# EAGLE design sd_tos (EAGLE 6.2)
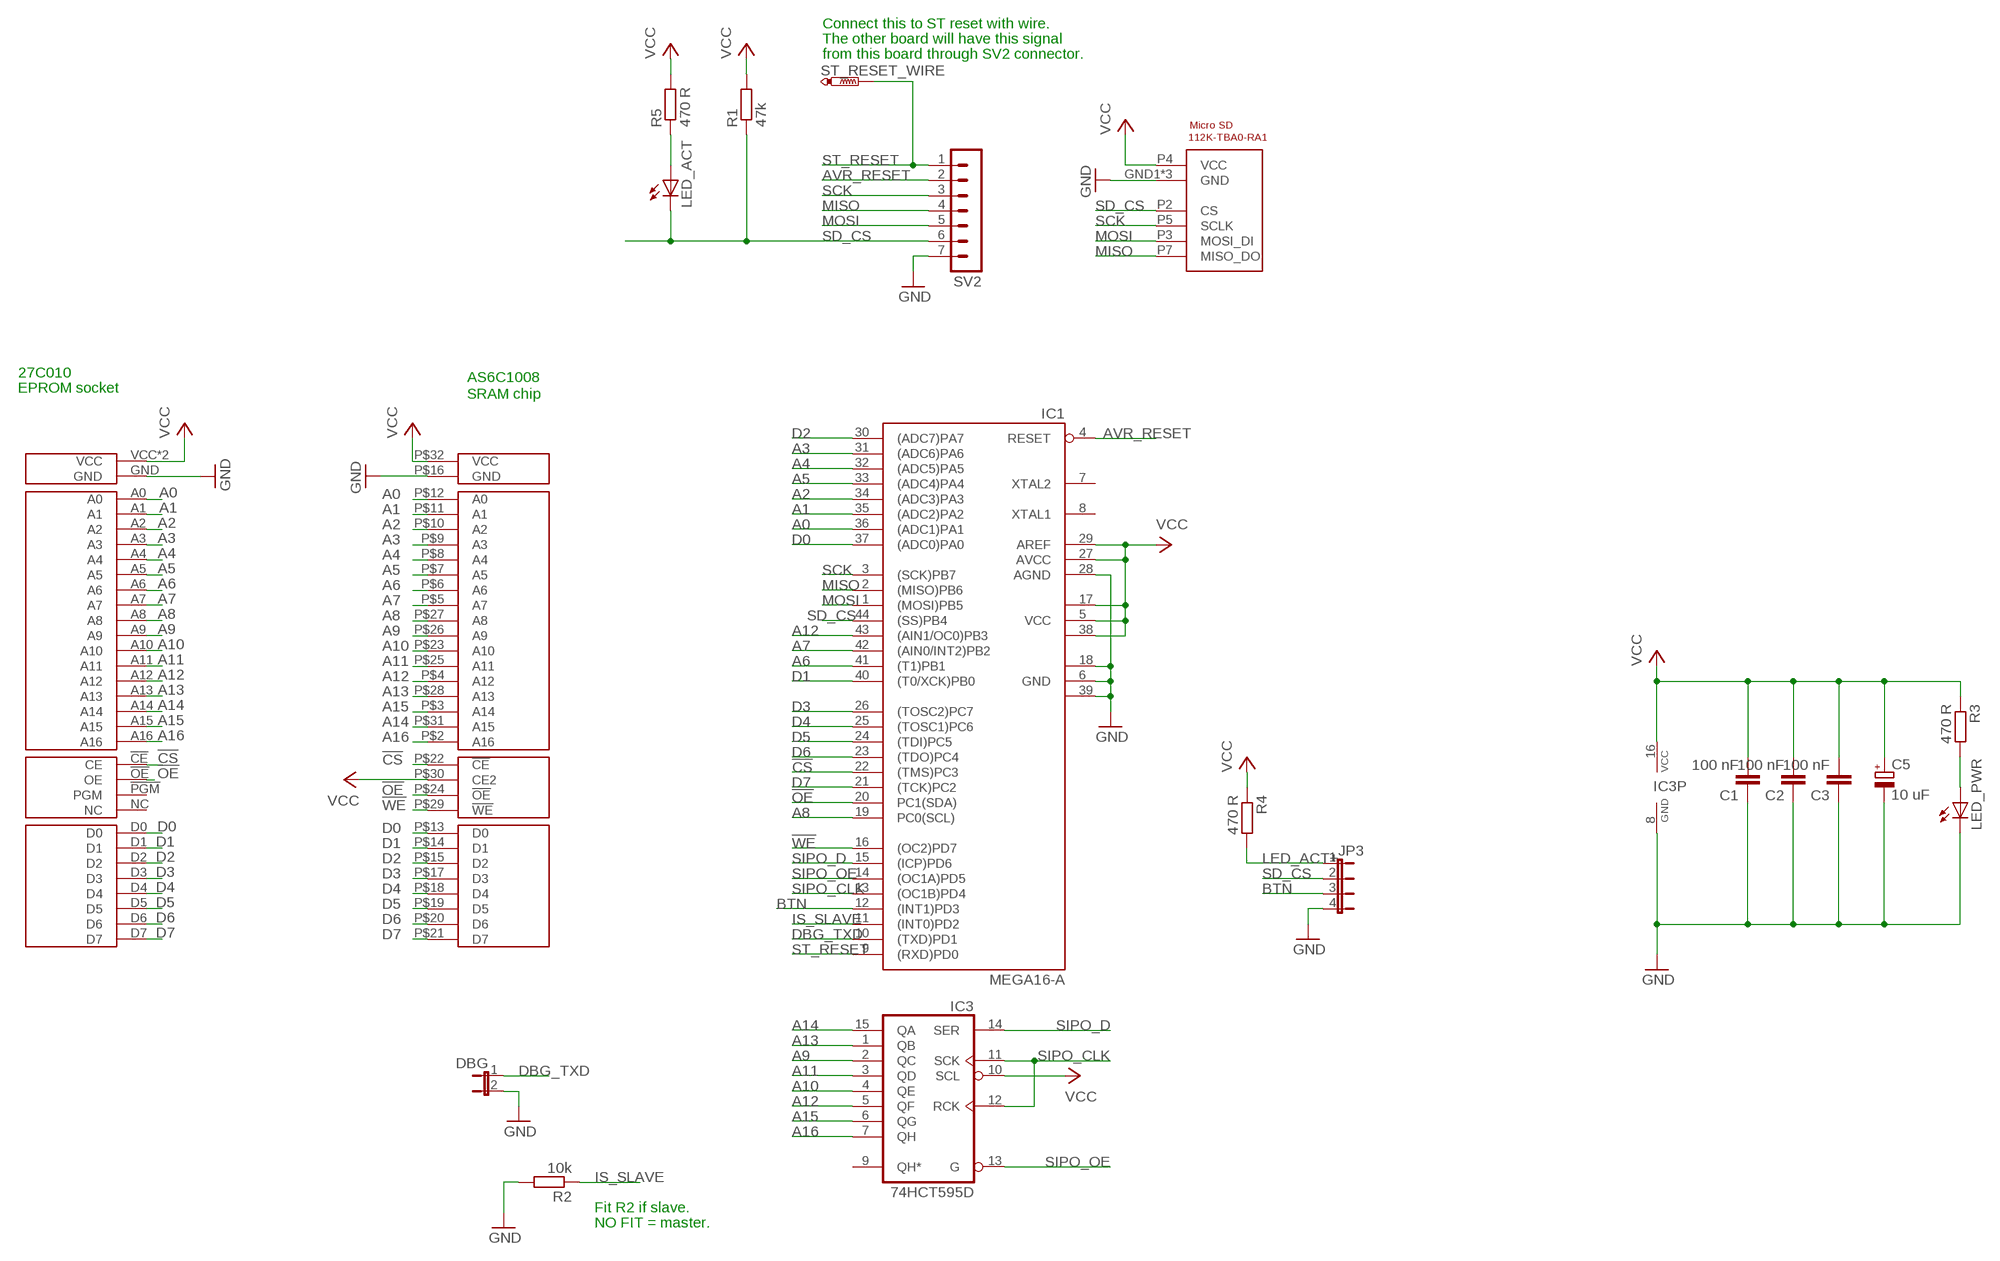
[diagram p0: schematic, sheet 1]

## Parts
C1  100 nF  C-EUC0603  [C0603]
C2  100 nF  C-EUC0603  [C0603]
C3  100 nF  C-EUC0603  [C0603]
C5  10 uF  CPOL-EUSANYO_SMD_B6  [SANYO-OSCON_SMD_B6]
DBG  JP1E  [JP1]
IC1  MEGA16-A  [TQFP44]
IC3  74HCT595D  [SO16]
JP3  JP4E  [JP4]
LED_ACT  LEDCHIP-LED0805  [CHIP-LED0805]
LED_PWR  LEDCHIP-LED0805  [CHIP-LED0805]
R1  47k  R-EU_R0603  [R0603]
R2  10k  R-EU_R0603  [R0603]
R3  470 R  R-EU_R0603  [R0603]
R4  470 R  R-EU_R0603  [R0603]
R5  470 R  R-EU_R0603  [R0603]
ST_RESET_WIRE  PTR1PAD1-13Y  [P1-13Y]
SV2  MA07-1  [MA07-1]
U$1  27C010_BOTTOM_ONLY  [DIP32_BOTTOM_ONLY]
U$2  AS6C1008  [SOP32L]
U$3  MICRO_SD  [MICRO_SD]

## Nets
!CS: IC1.22((TMS)PC3) U$1.!CE(CE) U$2.P$22(!CE)
!OE: IC1.20(PC1(SDA)) U$1.!OE(OE) U$2.P$24(!OE)
!WE: IC1.16((OC2)PD7) U$2.P$29(!WE)
A0: IC1.36((ADC1)PA1) U$1.A0 U$2.P$12(A0)
A1: IC1.35((ADC2)PA2) U$1.A1 U$2.P$11(A1)
A2: IC1.34((ADC3)PA3) U$1.A2 U$2.P$10(A2)
A3: IC1.31((ADC6)PA6) U$1.A3 U$2.P$9(A3)
A4: IC1.32((ADC5)PA5) U$1.A4 U$2.P$8(A4)
A5: IC1.33((ADC4)PA4) U$1.A5 U$2.P$7(A5)
A6: IC1.41((T1)PB1) U$1.A6 U$2.P$6(A6)
A7: IC1.42((AIN0/INT2)PB2) U$1.A7 U$2.P$5(A7)
A8: IC1.19(PC0(SCL)) U$1.A8 U$2.P$27(A8)
A9: IC3.2(QC) U$1.A9 U$2.P$26(A9)
A10: IC3.4(QE) U$1.A10 U$2.P$23(A10)
A11: IC3.3(QD) U$1.A11 U$2.P$25(A11)
A12: IC1.43((AIN1/OC0)PB3) IC3.5(QF) U$1.A12 U$2.P$4(A12)
A13: IC3.1(QB) U$1.A13 U$2.P$28(A13)
A14: IC3.15(QA) U$1.A14 U$2.P$31(A15)
A15: IC3.6(QG) U$1.A15 U$2.P$3(A14)
A16: IC3.7(QH) U$1.A16 U$2.P$2(A16)
AVR_RESET: IC1.4(RESET) SV2.2
BTN: IC1.12((INT1)PD3) JP3.3
D0: IC1.37((ADC0)PA0) U$1.D0 U$2.P$13(D0)
D1: IC1.40((T0/XCK)PB0) U$1.D1 U$2.P$14(D1)
D2: IC1.30((ADC7)PA7) U$1.D2 U$2.P$15(D2)
D3: IC1.26((TOSC2)PC7) U$1.D3 U$2.P$17(D3)
D4: IC1.25((TOSC1)PC6) U$1.D4 U$2.P$18(D4)
D5: IC1.24((TDI)PC5) U$1.D5 U$2.P$19(D5)
D6: IC1.23((TDO)PC4) U$1.D6 U$2.P$20(D6)
D7: IC1.21((TCK)PC2) U$1.D7 U$2.P$21(D7)
DBG_TXD: DBG.1 IC1.10((TXD)PD1)
GND: C1.1 C2.1 C3.1 C5.- DBG.2 IC1.6(GND) IC1.18(GND1) IC1.28(AGND) IC1.39(GND2) IC3.8(GND) JP3.4 LED_PWR.C R2.2 SV2.7 U$1.GND U$2.P$16(GND) U$3.GND1(GND) U$3.GND2(GND) U$3.P6(GND)
IS_SLAVE: IC1.11((INT0)PD2) R2.1
LED_ACT+: JP3.1 R4.2
MISO: IC1.2((MISO)PB6) SV2.4 U$3.P7(MISO_DO)
MOSI: IC1.1((MOSI)PB5) SV2.5 U$3.P3(MOSI_DI)
N$1: LED_PWR.A R3.2
N$2: LED_ACT.A R5.1
SCK: IC1.3((SCK)PB7) SV2.3 U$3.P5(SCLK)
SD_CS: IC1.44((SS)PB4) JP3.2 LED_ACT.C R1.1 SV2.6 U$3.P2(CS)
SIPO_CLK: IC1.13((OC1B)PD4) IC3.11(SCK) IC3.12(RCK)
SIPO_D: IC1.15((ICP)PD6) IC3.14(SER)
SIPO_OE: IC1.14((OC1A)PD5) IC3.13(G)
ST_RESET: IC1.9((RXD)PD0) ST_RESET_WIRE.TP SV2.1
VCC: C1.2 C2.2 C3.2 C5.+ IC1.5(VCC) IC1.17(VCC1) IC1.27(AVCC) IC1.29(AREF) IC1.38(VCC2) IC3.10(SCL) IC3.16(VCC) R1.2 R3.1 R4.1 R5.2 U$1.VCC U$1.VPP(VCC) U$2.P$30(CE2) U$2.P$32(VCC) U$3.P4(VCC)
Unconnected: IC1.7(XTAL2) IC1.8(XTAL1) IC3.9(QH*) U$1.!PGM(PGM) U$1.NC

## Notes on the sheet
- Connect this to ST reset with wire.
- The other board will have this signal
- from this board through SV2 connector.
- 27C010
- AS6C1008
- EPROM socket
- SRAM chip
- Fit R2 if slave.
- NO FIT = master.

## Library data of the parts
C1-C3 = rcl:C-EU: CAPACITOR, European symbol
C5 = rcl:CPOL-EU: POLARIZED CAPACITOR, European symbol
DBG = jumper:JP1E: JUMPER
IC1 = avr-6:MEGA16: MICROCONTROLLER 16 Kbytes FLASH 1 kbytes SRAM 512 bytes EEPROM USART 8-channel 10 bit ADC
IC3 = 74xx-eu:74*595: 8-bit SHIFT REGISTER, output latch
JP3 = jumper:JP4E: JUMPER
LED_ACT LED_PWR = led:LED: LED OSRAM: - CHIPLED LG R971, LG N971, LY N971, LG Q971, LY Q971, LO R971, LY R971 LH N974, LH R974 LS Q976, LO Q976, LY Q976 LO Q996 - Hyper CHIPLED LW Q18S LB Q993, LB Q99A, LB R99A - SideLED LS A670, LO A670, LY A670, LG A670, LP A670 LB A673, LV A673, LT A673, LW A673 LH A674 LY A675 LS A676, LA A676, LO A676, LY A676, LW A676 LS A679, LY A679, LG A679 - Hyper Micro SIDELED® LS Y876, LA Y876, LO Y876, LY Y876 LT Y87S - SmartLED LW L88C, LW L88S LB L89C, LB L89S, LG L890 LS L89K, LO L89K, LY L89K LS L896, LA L896, LO L896, LY L896 - TOPLED LS T670, LO T670, LY T670, LG T670, LP T670 LSG T670, LSP T670, LSY T670, LOP T670, LYG T670 LG T671, LOG T671, LSG T671 LB T673, LV T673, LT T673, LW T673 LH T674 LS T676, LA T676, LO T676, LY T676, LB T676, LH T676, LSB T676, LW T676 LB T67C, LV T67C, LT T67C, LS T67K, LO T67K, LY T67K, LW E67C LS E67B, LA E67B, LO E67B, LY E67B, LB E67C, LV E67C, LT E67C LW T67C LS T679, LY T679, LG T679 LS T770, LO T770, LY T770, LG T770, LP T770 LB T773, LV T773, LT T773, LW T773 LH T774 LS E675, LA E675, LY E675, LS T675 LS T776, LA T776, LO T776, LY T776, LB T776 LHGB T686 LT T68C, LB T68C - Hyper Mini TOPLED® LB M676 - Mini TOPLED Santana® LG M470 LS M47K, LO M47K, LY M47K Source: http://www.osram.convergy.de LUXEON: - LUMILED® LXK2-PW12-R00, LXK2-PW12-S00, LXK2-PW14-U00, LXK2-PW14-V00 LXK2-PM12-R00, LXK2-PM12-S00, LXK2-PM14-U00 LXK2-PE12-Q00, LXK2-PE12-R00, LXK2-PE12-S00, LXK2-PE14-T00, LXK2-PE14-U00 LXK2-PB12-K00, LXK2-PB12-L00, LXK2-PB12-M00, LXK2-PB14-N00, LXK2-PB14-P00, LXK2-PB14-Q00 LXK2-PR12-L00, LXK2-PR12-M00, LXK2-PR14-Q00, LXK2-PR14-R00 LXK2-PD12-Q00, LXK2-PD12-R00, LXK2-PD12-S00 LXK2-PH12-R00, LXK2-PH12-S00 LXK2-PL12-P00, LXK2-PL12-Q00, LXK2-PL12-R00 Source: www.luxeon.com KINGBRIGHT: KA-3528ASYC Source: www.kingbright.com
R1-R5 = rcl:R-EU_: RESISTOR, European symbol
ST_RESET_WIRE = testpad:PTR1: TEST PIN
SV2 = con-lstb:MA07-1: PIN HEADER; OC_FARNELL: unknown; OC_NEWARK: unknown
U$1 = sd_tos:27C010_BOTTOM_ONLY
U$2 = sd_tos:AS6C1008
U$3 = sd_tos:MICRO_SD

## Board
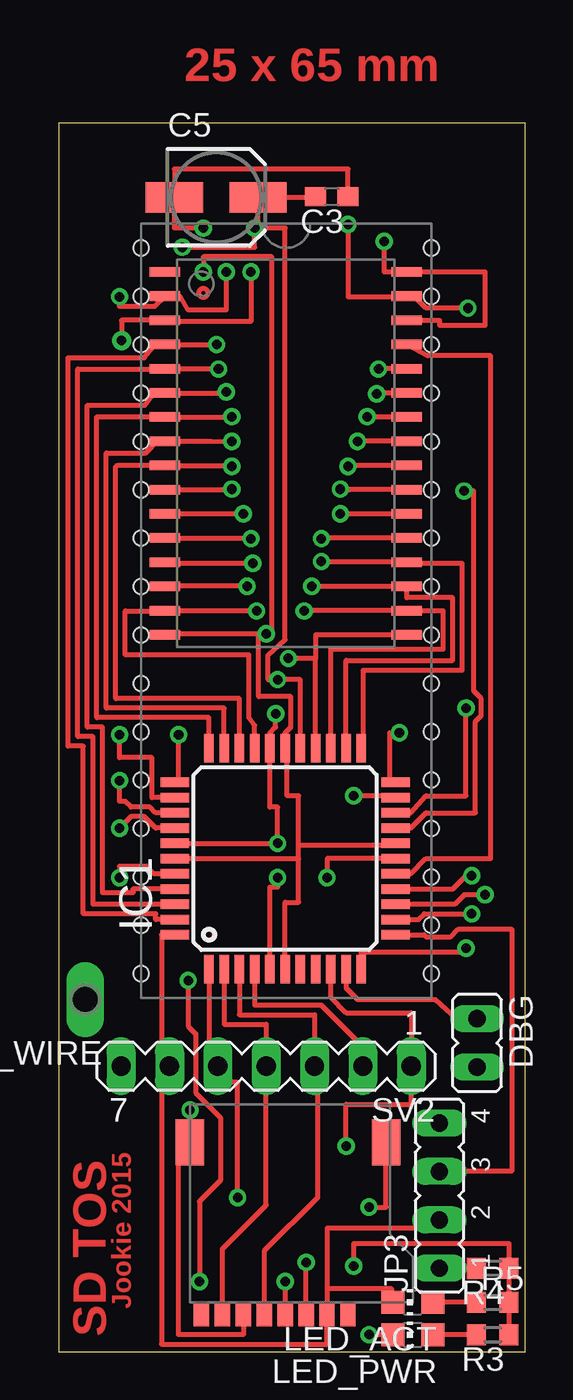
[diagram p1: board, top side]
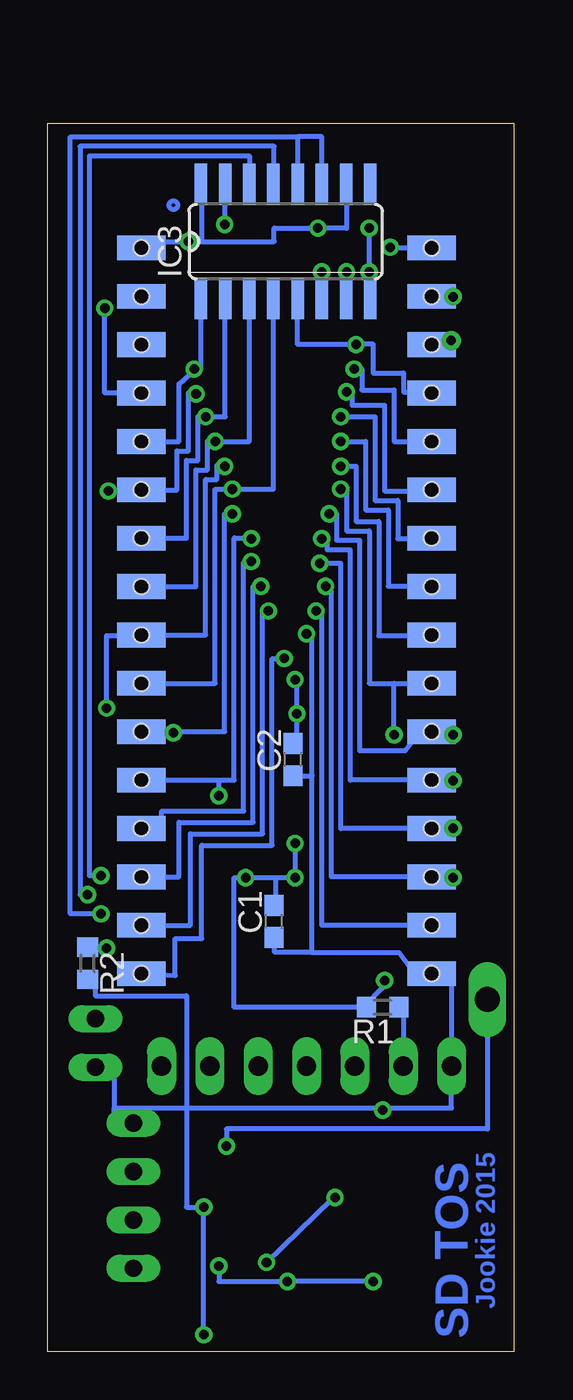
[diagram p2: board, bottom side, seen from below]

Size 24.5 x 64.5 mm. Coordinates in mm from the lower left corner, seen from the top.
Outline: 0,0 24.5,0 24.5,64.5 0,64.5 0,0
Copper layers (1*16): Top 0.035mm / dielectric 1.5mm / Bottom 0.035mm
Design rules: minimum track width 0.2mm, minimum drill 0.5mil, track to track 0.2mm, track to pad 0.2mm, pad to pad 0.2mm, via to via 0.2mm, smd to smd 0mil, copper to edge 0.1mm, drill to drill 0.1mm, minimum pad ring 10mil, minimum via ring 8mil, stop-mask expansion 4mil, vias tented up to drill 0mil, thermal gap 10mil

### Footprints (pad centres in the part's own frame; a part is rotated, then mirrored left to right if it is on the bottom)
C0603 = smd 1.1 x 1: 1 -0.85,0; 2 0.85,0
SANYO-OSCON_SMD_B6 = smd 3 x 1.6: + 2.2,0; - -2.2,0
JP1 = drill 0.914 long: 1 0,-1.27; 2 0,1.27
TQFP44 = smd 1.5 x 0.5: 1 -5.8,4; 2 -5.8,3.2; 3 -5.8,2.4; 4 -5.8,1.6; 5 -5.8,0.8; 6 -5.8,0; 7 -5.8,-0.8; 8 -5.8,-1.6; 9 -5.8,-2.4; 10 -5.8,-3.2; 11 -5.8,-4; 23 5.8,-4; 24 5.8,-3.2; 25 5.8,-2.4; 26 5.8,-1.6; 27 5.8,-0.8; 28 5.8,0; 29 5.8,0.8; 30 5.8,1.6; 31 5.8,2.4; 32 5.8,3.2; 33 5.8,4 | smd 0.5 x 1.5: 12 -4,-5.8; 13 -3.2,-5.8; 14 -2.4,-5.8; 15 -1.6,-5.8; 16 -0.8,-5.8; 17 0,-5.8; 18 0.8,-5.8; 19 1.6,-5.8; 20 2.4,-5.8; 21 3.2,-5.8; 22 4,-5.8; 34 4,5.8; 35 3.2,5.8; 36 2.4,5.8; 37 1.6,5.8; 38 0.8,5.8; 39 0,5.8; 40 -0.8,5.8; 41 -1.6,5.8; 42 -2.4,5.8; 43 -3.2,5.8; 44 -4,5.8
SO16 = smd 0.66 x 2.032: 1 -4.445,-3.073; 2 -3.175,-3.073; 3 -1.905,-3.073; 4 -0.635,-3.073; 5 0.635,-3.073; 6 1.905,-3.073; 7 3.175,-3.073; 8 4.445,-3.073; 9 4.445,3.073; 10 3.175,3.073; 11 1.905,3.073; 12 0.635,3.073; 13 -0.635,3.073; 14 -1.905,3.073; 15 -3.175,3.073; 16 -4.445,3.073
JP4 = drill 0.914 long: 1 -3.81,0; 2 -1.27,0; 3 1.27,0; 4 3.81,0
CHIP-LED0805 = smd 1.2 x 1.2: A 0,-1.05; C 0,1.05
R0603 = smd 1 x 1.1: 1 -0.85,0; 2 0.85,0
P1-13Y = drill 1.321 pad 1.905 long: TP 0,0
MA07-1 = drill 1.016 long: 1 -7.62,0; 2 -5.08,0; 3 -2.54,0; 4 0,0; 5 2.54,0; 6 5.08,0; 7 7.62,0
DIP32_BOTTOM_ONLY = smd 2.54 x 1.3 bottom: !CE 7.62,-5.08; !OE 7.62,0; !PGM 7.62,17.78; A0 -7.62,-7.62; A1 -7.62,-5.08; A2 -7.62,-2.54; A3 -7.62,0; A4 -7.62,2.54; A5 -7.62,5.08; A6 -7.62,7.62; A7 -7.62,10.16; A8 7.62,7.62; A9 7.62,5.08; A10 7.62,-2.54; A11 7.62,2.54; A12 -7.62,12.7; A13 7.62,10.16; A14 7.62,12.7; A15 -7.62,15.24; A16 -7.62,17.78; D0 -7.62,-10.16; D1 -7.62,-12.7; D2 -7.62,-15.24; D3 7.62,-17.78; D4 7.62,-15.24; D5 7.62,-12.7; D6 7.62,-10.16; D7 7.62,-7.62; GND -7.62,-17.78; NC 7.62,15.24; VCC 7.62,20.32; VPP -7.62,20.32 | hole 0.8: -7.62,20.32; -7.62,17.78; -7.62,15.24; -7.62,12.7; -7.62,10.16; -7.62,7.62; -7.62,5.08; -7.62,2.54; -7.62,0; -7.62,-2.54; -7.62,-5.08; -7.62,-7.62; -7.62,-10.16; -7.62,-12.7; -7.62,-15.24; -7.62,-17.78; 7.62,-17.78; 7.62,-15.24; 7.62,-12.7; 7.62,-10.16; 7.62,-7.62; 7.62,-5.08; 7.62,-2.54; 7.62,0; 7.62,2.54; 7.62,5.08; 7.62,7.62; 7.62,10.16; 7.62,12.7; 7.62,15.24; 7.62,17.78; 7.62,20.32
SOP32L = smd 1.6 x 0.5: P$1 -7.62,12.7; P$2 -7.62,11.43; P$3 -7.62,10.16; P$4 -7.62,8.89; P$5 -7.62,7.62; P$6 -7.62,6.35; P$7 -7.62,5.08; P$8 -7.62,3.81; P$9 -7.62,2.54; P$10 -7.62,1.27; P$11 -7.62,0; P$12 -7.62,-1.27; P$13 -7.62,-2.54; P$14 -7.62,-3.81; P$15 -7.62,-5.08; P$16 -7.62,-6.35; P$17 5.08,-6.35; P$18 5.08,-5.08; P$19 5.08,-3.81; P$20 5.08,-2.54; P$21 5.08,-1.27; P$22 5.08,0; P$23 5.08,1.27; P$24 5.08,2.54; P$25 5.08,3.81; P$26 5.08,5.08; P$27 5.08,6.35; P$28 5.08,7.62; P$29 5.08,8.89; P$30 5.08,10.16; P$31 5.08,11.43; P$32 5.08,12.7
MICRO_SD = smd 1.5 x 2.4: GND1 -5,9; GND2 5.3,9 | smd 0.8 x 1.3: P1 3.3,0; P2 2.2,0; P3 1.1,0; P4 0,0; P5 -1.1,0; P6 -2.2,0; P7 -3.3,0; P8 -4.4,0

### Placement (x,y rotation side)
C1  12.6,22.6 90 bottom
C2  11.6,31.1 90 bottom
C3  14.35,60.64 180 top
C5  8.28,60.62 0 top
DBG  21.99,16.22 180 top
IC1  11.9,25.9 90 top
IC3  12,58.3 0 bottom
JP3  20,8.2 90 top
LED_ACT  18.6,2.6 90 top
LED_PWR  18.6,0.9 90 top
R1  6.9,18.1 180 bottom
R2  22.4,20.4 270 bottom
R3  22.8,0.9 180 top
R4  22.8,4.4 180 top
R5  22.8,2.6 0 top
ST_RESET_WIRE  1.4,18.5 180 top
SV2  10.9,15 180 top
U$1  11.95,37.64 0 top
U$2  13.2,44 0 top
U$3  11.9,2 0 top

### Tracks (layer width: path | path; a pad name or v marks a point on that pad's centre or on a via)
!CS  (via drill 0.5 pad 0.8)
  Top 0.25: U$2.P$22 v14.8,44 | 17.8,29.9 IC1.22 17.4,29.9 17.4,32.5 v17.9,32.5
  Bottom 0.25: U$1.!CE 18.9,32.56 | 18.9,32.56 15.2,32.56 15.2,44 v14.8,44 | v17.9,32.5 18.9,32.56
!OE  (via drill 0.5 pad 0.8)
  Top 0.25: U$2.P$24 15.3,46.54 v15.2,46.5 | IC1.20 18.5,28.3 19.3,29.2 21.4,29.2 v21.4,33.8
  Bottom 0.25: v15.2,46.5 15.3,46.54 15.6,46.54 15.6,45.8 16.2,45.8 16.2,37.64 U$1.!OE 19.57,37.6 21.4,37.6 v21.4,33.8
!WE
  Top 0.25: IC1.16 18.5,25.1 19.3,25.9 22.7,25.9 22.7,52.3 19.37,52.3 U$2.P$29
A0  (via drill 0.5 pad 0.8)
  Top 0.25: v10.1,42.7 5.58,42.7 U$2.P$12 | IC1.36 5.1,28.3 4.8,28.6 3.8,28.6 3.5,28.9 3.2,28.9 v3.2,30
  Bottom 0.25: v10.1,42.7 9.8,42.7 9.8,42.1 8.6,42.1 8.6,30.02 U$1.A0 4.31,30 v3.2,30
A1  (via drill 0.5 pad 0.8)
  Top 0.25: v9.7,44 U$2.P$11 | IC1.35 4.9,29.1 4.9,31.2 3.2,31.2 v3.2,32.4
  Bottom 0.25: v9.7,44 9.3,44 9.3,42.6 8.1,42.6 8.1,31.56 5.72,31.55 4.92,32.57 U$1.A1 4.33,32.5 v3.2,32.4
A2  (via drill 0.5 pad 0.8)
  Top 0.25: U$2.P$10 8.9,45.27 v9.1,45.3 | IC1.34 6.3,29.9 v6.3,32.4
  Bottom 0.25: v9.1,45.3 8.8,45.3 8.8,43.1 7.6,43.1 7.6,35.1 6.3,35.1 | 6.3,35.1 U$1.A2 | v6.3,32.4 6.3,35.1
A3  (via drill 0.5 pad 0.8)
  Top 0.25: v9.1,46.5 9.1,46.54 U$2.P$9 3.1,46.54 3,46.5 3,34.3 9.5,34.3 IC1.31
  Bottom 0.25: v9.1,46.5 8.3,46.5 8.3,43.6 7.1,43.6 7.1,37.6 4.33,37.6 U$1.A3
A4  (via drill 0.5 pad 0.8)
  Top 0.25: U$2.P$8 8,47.81 v9.1,47.8 | 5.17,47.8 5.2,47.8 U$2.P$8 | IC1.32 8.7,33.8 2.5,33.8 2.5,47.2 4.57,47.2 4.9,47.53 5.1,47.8 U$2.P$8
  Bottom 0.25: v9.1,47.8 7.8,47.8 7.8,44.2 6.6,44.2 6.6,40.2 4.33,40.2 U$1.A4
A5  (via drill 0.5 pad 0.8)
  Top 0.25: v9.1,49.1 9.1,49.08 U$2.P$7 5.58,49.1 2,49.1 2,33.3 7.9,33.3 IC1.33
  Bottom 0.25: v9.1,49.1 7.3,49.1 7.3,44.7 6.1,44.7 6.1,42.7 4.33,42.7 U$1.A5
A6  (via drill 0.5 pad 0.8)
  Top 0.25: v8.8,50.4 8.5,50.35 U$2.P$6 5.53,50.3 5,50.3 4.53,49.7 1.5,49.7 1.5,32.8 2.3,32.8 2.3,24.1 3.9,24.1 3.9,24.3 IC1.41
  Bottom 0.25: v8.8,50.4 8.5,50.4 8.5,49.7 6.8,49.7 6.8,45.2 4.33,45.2 U$1.A6
A7  (via drill 0.5 pad 0.8)
  Top 0.25: v8.4,51.6 8.4,51.62 U$2.P$5 5.58,51.6 1,51.6 1,32.3 1.8,32.3 1.8,23.5 IC1.42
  Bottom 0.25: v8.4,51.6 8,51.6 8,50.5 6.3,50.5 6.3,47.8 U$1.A7
A8  (via drill 0.5 pad 0.8)
  Top 0.25: U$2.P$27 17,50.35 v16.7,50.3 | IC1.19 18.5,27.5 19.3,28.3 21.9,28.3 21.9,33.1 22.2,33.4 22.2,34.3 21.8,34.7 21.8,45.2 v21.3,45.2
  Bottom 0.25: v16.7,50.3 16.9,50.35 17.1,50.35 17.1,47.3 17.7,47.3 17.7,45.26 U$1.A8 19.57,45.2 v21.3,45.2
A9  (via drill 0.5 pad 0.8)
  Top 0.25: U$2.P$26 16.3,49.08 v16.2,49.1
  Bottom 0.25: U$1.A9 17.2,42.72 17.2,46.8 16.6,46.8 16.6,49.08 16.4,49.08 v16.2,49.1 15.17,49.1 IC3.2
A10  (via drill 0.5 pad 0.8)
  Top 0.25: U$2.P$23 15.3,45.27 v14.8,45.3
  Bottom 0.25: U$1.A10 15.7,35.1 15.7,45.3 15.1,45.3 15.1,45.27 15,45.27 v14.8,45.3 12.63,45.3 IC3.4
A11  (via drill 0.5 pad 0.8)
  Top 0.25: U$2.P$25 15.8,47.81 v15.7,47.8
  Bottom 0.25: U$1.A11 16.7,40.18 16.7,46.3 16.1,46.3 16.1,47.81 v15.7,47.8 13.91,47.8 IC3.3
A12  (via drill 0.5 pad 0.8)
  Top 0.25: v8.3,52.89 U$2.P$4 5.1,52.9 4.49,52.2 0.5,52.2 0.5,31.8 1.3,31.8 1.3,23 5.1,23 5.1,22.7 IC1.43
  Bottom 0.25: U$1.A12 4.33,50.4 5.8,50.4 5.8,51.4 7.4,51.4 7.4,52.9 v8.3,52.9 v8.3,52.89 11.37,52.89 IC3.5
A13  (via drill 0.5 pad 0.8)
  Top 0.25: U$2.P$28 16.8,51.62 v16.8,51.6
  Bottom 0.25: U$1.A13 17.6,47.8 17.6,50.82 16.7,51.62 v16.8,51.6 16.8,51.62 16.45,51.62 IC3.1
A14  (via drill 0.5 pad 0.8)
  Top 0.25: v21.5,54.8 19.3,54.8 18.8,55.3 18.41,55.3 U$2.P$31 18.28,55.4 15.2,55.4 v15.2,59.2
  Bottom 0.25: U$1.A14 21.5,50.34 v21.5,54.8 | IC3.15 15.2,61.37 v15.2,59.2
A15  (via drill 0.5 pad 0.8, 0.5 pad 1)
  Top 0.25: v3.3,53.1 3.3,54.16 U$2.P$3 5.58,54.1 10.1,54.1 v10.1,56.7
  Bottom 0.25: v3.3,53.1 4.33,52.9 U$1.A15 | IC3.6 v10.1,56.7
A16  (via drill 0.5 pad 0.8)
  Top 0.25: v3.2,55.4 3.2,54.9 5.05,54.9 U$2.P$2 5.58,55.4 6.4,55.4 6.8,54.7 8.8,54.7 v8.8,56.7
  Bottom 0.25: U$1.A16 3.22,55.42 v3.2,55.4 | IC3.7 8.8,55.23 v8.8,56.7
AVR_RESET
  Top 0.2: SV2.2 15.8,15 15.8,16.2
  Top 0.25: IC1.4 10.3,18.2 13.8,18.2 15.8,16.2
BTN
  Top 0.25: IC1.12 19.2,21.9 19.3,21.8 20.6,21.8 21,22.2 23.8,22.2 23.8,9.48 JP3.3
D0  (via drill 0.5 pad 0.8)
  Top 0.25: v10.2,41.4 5.58,41.4 U$2.P$13 | IC1.37 5.1,27.5 4.5,28.1 3.8,28.1 v3.2,27.5
  Bottom 0.25: v10.2,41.4 9.1,41.4 9.1,27.48 U$1.D0 4.31,27.5 v3.2,27.5
D1  (via drill 0.5 pad 0.8)
  Top 0.25: v9.9,40.2 U$2.P$14 | IC1.40 5,25.1 4.6,25.5 3.2,25.5 v3.2,24.9
  Bottom 0.25: v9.9,40.2 9.6,40.2 9.6,24.94 U$1.D1 4.19,24.8 3.2,24.8 v3.2,24.9
D2  (via drill 0.5 pad 0.8)
  Top 0.25: v10.4,38.9 5.58,38.9 | IC1.30 10.3,32.9 10,33.3 10,36.6 3.5,36.6 3.5,38.9 5.58,38.9 | 5.58,38.9 U$2.P$15
  Bottom 0.25: U$1.D2 10.1,22.4 10.1,38.9 v10.4,38.9
D3  (via drill 0.5 pad 0.8)
  Top 0.25: U$2.P$17 13.5,37.65 13.5,36.4 | IC1.26 13.5,36.4 | 13.5,36.4 v12.07,36.41
  Bottom 0.25: U$1.D3 17.8,19.76 17.8,21.7 16.4,21.7 16.4,26.6 12.7,26.6 12.7,36.4 v12.07,36.41
D4  (via drill 0.5 pad 0.8)
  Top 0.25: v12.9,38.9 12.9,38.92 U$2.P$18 18.28,38.9 20.2,38.9 20.2,36.9 14.3,36.9 IC1.25
  Bottom 0.25: U$1.D4 17,22.4 17,27.2 13.2,27.2 13.2,38.9 v12.9,38.9
D5  (via drill 0.5 pad 0.8)
  Top 0.25: v13.3,40.2 v13.3,40.19 U$2.P$19 18.28,39.6 20.7,39.6 20.7,36.3 15.1,36.3 IC1.24
  Bottom 0.25: U$1.D5 17.6,24.94 17.6,27.8 13.7,27.8 13.7,40.19 13.2,40.19 v13.3,40.2
D6  (via drill 0.5 pad 0.8)
  Top 0.25: v13.8,41.5 13.9,41.46 U$2.P$20 18.28,41.4 21.2,41.4 21.2,35.8 16,35.8 16,31.7 IC1.23
  Bottom 0.25: U$1.D6 18.5,27.48 18.5,28.4 14.2,28.4 14.2,41.46 13.9,41.46 v13.8,41.5
D7  (via drill 0.5 pad 0.8)
  Top 0.25: U$2.P$21 13.7,42.73 v13.8,42.7 | IC1.21 17.7,29.2 v15.5,29.2
  Bottom 0.25: U$1.D7 15.5,30.02 | 15.5,30.02 14.7,30.02 14.7,42.73 13.9,42.73 v13.8,42.7 | v15.5,29.2 15.5,30.02
DBG_TXD
  Top 0.25: IC1.10 15.1,19.1 15.7,18.5 19.8,18.5 20.9,17.5 22.1,17.5 DBG.1
GND  (via drill 0.5 pad 0.8)
  Top 0.25: 10.5,37.7 v10.9,37.7 11.2,37.7 11.2,57.5 7.6,57.5 v7.6,56.7 | 10.5,37.7 5.58,37.7 U$2.P$16 | v7.6,59 6.08,59 C5.- 6.08,62.1 15.2,62.1 C3.1 | 10.5,37.7 10.5,34.4 12.2,34.4 12.2,32.8 11.9,32.5 IC1.28 12,31.7 12,29.2 12.6,29.2 12.6,26.6 | IC1.39 12.6,25.9 | 12.6,25.9 12.6,26.6 | IC1.18 17.7,26.6 12.6,26.6 | IC1.6 11.9,23.6 12.6,23.6 12.6,25.9 | U$3.P6 9.7,0.9 6.3,0.9 6.3,11.1 6.9,11.1 U$3.GND1 v6.9,12.7 | v16.3,7.6 17.2,7.6 U$3.GND2 | LED_PWR.C v16.3,0.9
  Bottom 0.25: 10.6,21 10.6,30.25 | 10.6,30.25 10.6,37.7 v10.9,37.7 | IC3.8 7.6,55.23 v7.6,56.7 v7.6,59 | C2.1 10.6,30.25 | C1.1 12.6,21 10.6,21 | 10.6,21 10.6,20.96 6.02,20.96 5.2,19.85 U$1.GND 3.28,19.86 SV2.7 3.28,12.8 6.8,12.8 | DBG.2 21,14.93 21,12.8 | 21,12.8 17.2,12.8 | 17.2,12.8 6.8,12.8 | R2.2 22,19.55 22,18.7 17.2,18.7 17.2,12.8 | v6.9,12.7 6.8,12.8 | v16.3,0.9 v16.3,7.6 17.2,7.6 17.2,12.8 | JP3.4 21,12.01 21,12.8
IS_SLAVE  (via drill 0.5 pad 0.8)
  Top 0.25: IC1.11 15.9,21 21.2,21 v21.4,21.2
  Bottom 0.25: v21.4,21.2 22.4,21.2 R2.1
LED_ACT+
  Top 0.25: JP3.1 R4.2
MISO
  Top 0.25: IC1.2 8.7,17.2 10.9,17.2 SV2.4 10.9,7.7 8.6,5.4 U$3.P7
MOSI  (via drill 0.5 pad 0.8)
  Top 0.25: IC1.1 7.9,16.2 8.36,16.2 | U$3.P3 v13,4.7 | v9.4,8.1 9.4,14.15 8.36,14.15 SV2.5 8.36,16.2 | 8.53,16.2 8.36,16.2
  Bottom 0.25: v13,4.7 9.6,8 v9.4,8.1
N$1
  Top 0.25: R3.2 LED_PWR.A
N$2
  Top 0.25: R5.1 LED_ACT.A
SCK
  Top 0.25: IC1.3 9.5,17.7 13.44,17.7 SV2.3 13.44,15.3 13.6,15.3 13.6,8.1 10.8,5.3 U$3.P5
SD_CS
  Top 0.25: IC1.44 5.4,21.9 5.4,15 | 5.4,15 5.4,0.4 14.1,0.4 U$3.P2 14.1,3.3 | 14.1,3.3 14.1,6.5 19,6.5 19,6.93 JP3.2 | SV2.6 5.4,15 | LED_ACT.C 17.5,2.4 17.5,3.3 14.1,3.3
  Bottom 0.25: R1.1 5.82,18.1 SV2.6
SIPO_CLK  (via drill 0.5 pad 0.8)
  Top 0.25: IC1.13 18.9,22.7 19.2,23 v21.7,23
  Bottom 0.25: IC3.11 10.1,63.8 11.37,63.8 | 11.37,63.8 IC3.12 | v21.7,23 23.3,23 23.3,63.8 11.37,63.8
SIPO_D  (via drill 0.5 pad 0.8)
  Top 0.25: IC1.15 20.7,24.3 21.4,25 v21.7,25
  Bottom 0.25: v21.7,25 22.3,25 22.3,62.8 13.91,62.8 IC3.14
SIPO_OE  (via drill 0.5 pad 0.8)
  Top 0.25: v22.4,24 21.3,24 20.8,23.5 IC1.14
  Bottom 0.25: IC3.13 12.6,61.37 12.6,63.3 22.8,63.3 22.8,24 v22.4,24
ST_RESET  (via drill 0.5 pad 0.8)
  Top 0.25: IC1.9 14.3,18.6 15.1,17.8 18.52,17.8 SV2.1 18.52,13 15.1,13 v15.1,10.8
  Bottom 0.25: ST_RESET_WIRE.TP 1.4,11.7 15.1,11.7 v15.1,10.8
VCC  (via drill 0.5 pad 0.8)
  Top 0.25: 18.28,54.2 U$2.P$30 20,54.16 20,53.9 22.4,53.9 22.4,56.7 U$2.P$32 17.1,56.7 v17.1,58.3 | C3.2 13.5,60.62 C5.+ 10.48,59 v10.3,59 | IC1.27 12.7,35.3 v11.5,35.3 11,35.3 11,36.6 11.9,37.4 11.9,59 v10.3,59 | IC1.38 v11.5,26.7 11.5,28.6 11.1,28.6 IC1.29 11.1,32.5 11.4,32.8 v11.4,33.5 | v6.5,58 10.3,58 v10.3,59 | IC1.5 11.1,24.4 11.5,24.4 v11.5,24.9 | IC1.17 14.1,25.9 v14.1,24.9 | v6.8,19.5 6.8,17.1 7.2,16.7 7.2,13.6 8.5,12.3 8.5,9 7.4,7.9 v7.4,3.7 | v11.9,3.7 U$3.P4 | 23.9,0.9 R3.1 R5.2 R4.1 23.65,5.7 15.5,5.7 v15.5,4.5
  Bottom 0.25: IC3.10 8.8,61.37 8.8,58.99 v10.3,58.99 v10.3,59 12.6,59 12.6,58.3 16.4,58.3 | IC3.16 16.4,61.37 16.4,58.3 | 16.4,58.3 v17.1,58.3 18.7,58.3 18.7,57.96 U$1.VCC | U$1.VPP 6.5,57.96 v6.5,58 | v11.5,26.7 v11.5,24.9 12.5,24.9 | v11.5,35.3 11.4,35.3 v11.4,33.5 11.4,31.95 C2.2 | 12.5,24.9 v14.1,24.9 14.7,24.9 14.7,18.1 R1.2 7.75,18.25 6.9,19.1 v6.8,19.5 | C1.2 12.5,23.45 12.5,24.9 | v7.4,3.7 v11.9,3.7 15.5,3.7 v15.5,4.5
(copper drawn outside any net)
  shapes: Bottom circle x1, Top circle x2

### Text on the board
Top: 25 x 65 mm | Jookie 2015 | SD TOS
Bottom: Jookie 2015 | SD TOS